# EAGLE board 8Enc (EAGLE 6.5.0)
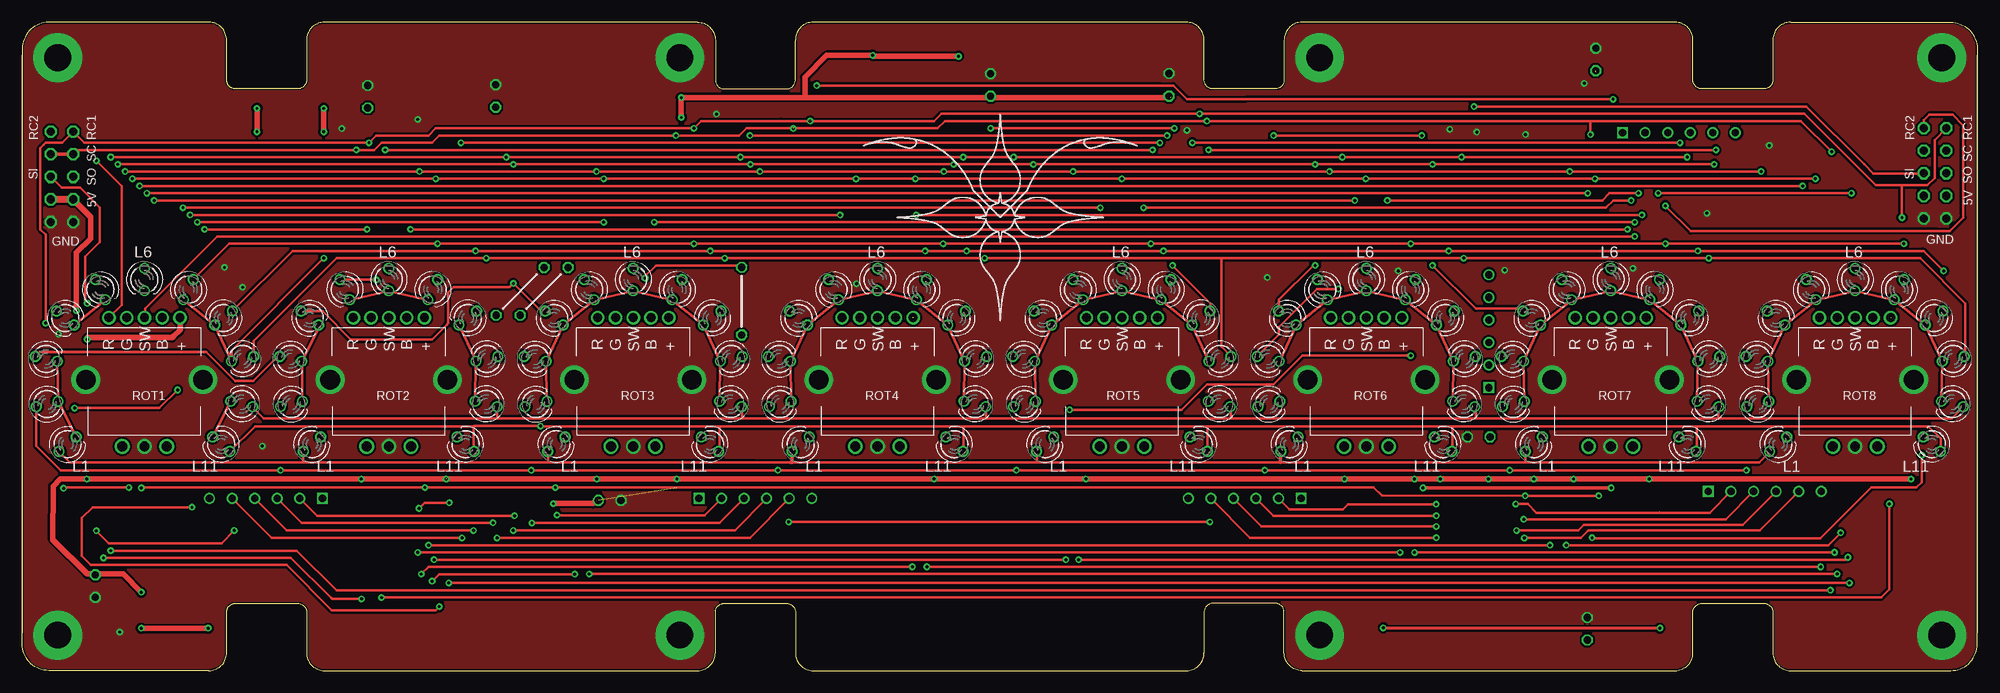
[diagram p2: board, top side]
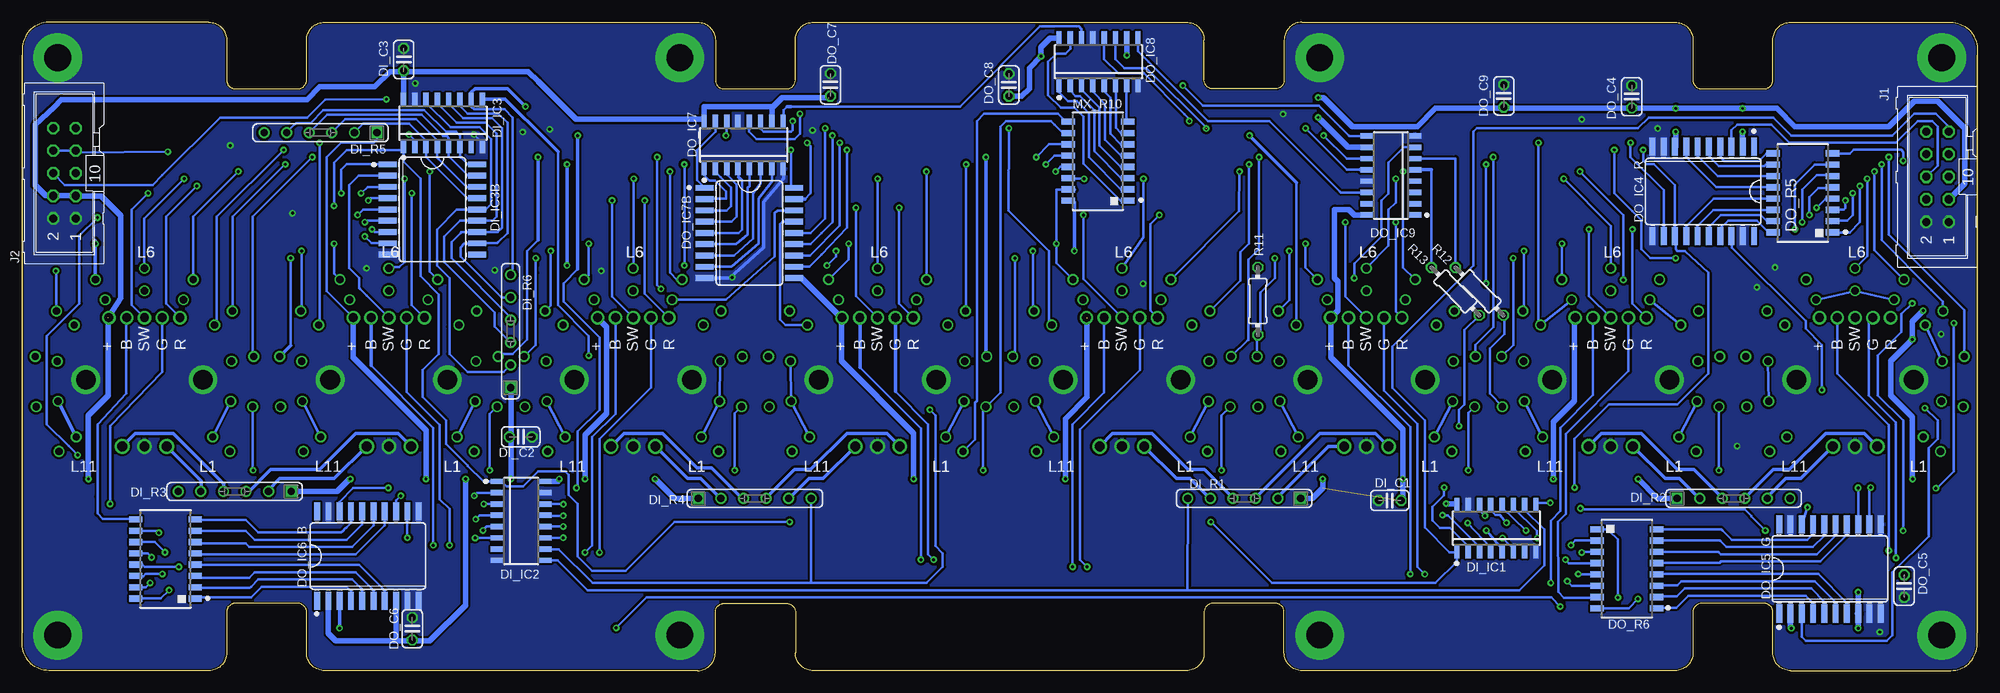
[diagram p3: board, bottom side, seen from below]

Size 220 x 73 mm. Coordinates in mm from the lower left corner, seen from the top.
Outline: 220,69.29 220,3 arc-90 217,0 199,0 arc-90 197,2 197,6.58 arc90 196,7.58 189,7.58 arc90 188,6.58 188,2 arc-90 186,0 144,0 arc-90 142,2 142,6.58 arc90 141,7.58 134,7.58 arc90 133,6.58 133,2 arc-90 131,0 89,0 arc-90 87,2 87,6.58 arc90 86,7.58 79,7.58 arc90 78,6.58 78,2 arc-90 76,0 34,0 arc-90 32,2 32,6.58 arc90 31,7.58 24,7.58 arc90 23,6.58 23,2 arc-90 21,0 3,0 arc-90 0,3 0,69.29
Outline: 0,4.28 0,70 arc-90 3,73 21,73 arc-90 23,71 23,66.5 arc90 24,65.5 31,65.5 arc90 32,66.5 32,71 arc-90 34,73 76,73 arc-90 78,71 78,66.5 arc90 79,65.5 86,65.5 arc90 87,66.5 87,71 arc-90 89,73 131,73 arc-90 133,71 133,66.5 arc90 134,65.5 141,65.5 arc90 142,66.5 142,71 arc-90 144,73 186,73 arc-90 188,71 188,66.5 arc90 189,65.5 196,65.5 arc90 197,66.5 197,71 arc-90 199,73 217,73 arc-90 220,70 220,4.28
Copper layers (1*16): Top 0.07mm / dielectric 1.6mm / Bottom 0.07mm
Design rules "001_MakePCB-8mil_min *": minimum track width 8mil, minimum drill 13mil, track to track 8mil, track to pad 8mil, pad to pad 8mil, via to via 8mil, smd to smd 8mil, copper to edge 8mil, drill to drill 8mil, minimum pad ring 8mil, minimum via ring 8mil, stop-mask expansion 2mil, vias tented up to drill 0mil, thermal gap 0mil
Net classes: 0 default: width 0.254 mm, drill 0.33 mm, clearance 0.254 mm; 1 VDD: width 0.61 mm, drill 0.33 mm, clearance 0.254 mm to class 0, clearance 0.254 mm

## Footprints (pad centres in the part's own frame; a part is rotated, then mirrored left to right if it is on the bottom)
C025-024X044 = drill 0.813 octagon: 1 -1.27,0; 2 1.27,0
SO16D = smd 0.6 x 1.4: 1 -4.481,-2.764; 2 -3.211,-2.764; 3 -1.941,-2.764; 4 -0.671,-2.764; 5 0.599,-2.764; 6 1.869,-2.764; 7 3.139,-2.764; 8 4.409,-2.764; 9 4.409,2.666; 10 3.139,2.666; 11 1.869,2.666; 12 0.599,2.666; 13 -0.671,2.666; 14 -1.941,2.666; 15 -3.211,2.666; 16 -4.481,2.666
SO18W = smd 0.66 x 2.032: 1 -5.08,-5.029; 2 -3.81,-5.029; 3 -2.54,-5.029; 4 -1.27,-5.029; 5 0,-5.029; 6 1.27,-5.029; 7 2.54,-5.029; 8 3.81,-5.029; 9 5.08,-5.029; 10 5.08,5.029; 11 3.81,5.029; 12 2.54,5.029; 13 1.27,5.029; 14 0,5.029; 15 -1.27,5.029; 16 -2.54,5.029; 17 -3.81,5.029; 18 -5.08,5.029
SIL6 = drill 0.813 square: 1 -6.35,0 | drill 0.813: 2 -3.81,0; 3 -1.27,0; 4 1.27,0; 5 3.81,0; 6 6.35,0
SO20W = smd 0.66 x 2.032: 1 -5.715,-5.029; 2 -4.445,-5.029; 3 -3.175,-5.029; 4 -1.905,-5.029; 5 -0.635,-5.029; 6 0.635,-5.029; 7 1.905,-5.029; 8 3.175,-5.029; 9 4.445,-5.029; 10 5.715,-5.029; 11 5.715,5.029; 12 4.445,5.029; 13 3.175,5.029; 14 1.905,5.029; 15 0.635,5.029; 16 -0.635,5.029; 17 -1.905,5.029; 18 -3.175,5.029; 19 -4.445,5.029; 20 -5.715,5.029
SOIC16W = smd 0.7 x 1.5: 1 -4.445,-3.346; 2 -3.175,-3.346; 3 -1.905,-3.346; 4 -0.635,-3.346; 5 0.635,-3.346; 6 1.905,-3.346; 7 3.175,-3.346; 8 4.445,-3.346; 9 4.445,3.346; 10 3.175,3.346; 11 1.905,3.346; 12 0.635,3.346; 13 -0.635,3.346; 14 -1.905,3.346; 15 -3.175,3.346; 16 -4.445,3.346
ML10 = drill 0.914 octagon: 1 -5.08,-1.27; 2 -5.08,1.27; 3 -2.54,-1.27; 4 -2.54,1.27; 5 0,-1.27; 6 0,1.27; 7 2.54,-1.27; 8 2.54,1.27; 9 5.08,-1.27; 10 5.08,1.27
0204/7 = drill 0.813 octagon: 1 -3.81,0; 2 3.81,0
PEL12T_11-LED-RING = drill 1.1: A -2.5,-7.5; B 2.5,-7.5; C 0,-7.5 | drill 0.813: A1 -9.619,-8.067; A2 -12.186,-3.035; A3 -12.289,2.612; A4 -9.894,7.73; A5 -5.505,11.287; A6 0,12.56; A7 5.508,11.288; A8 9.897,7.732; A9 12.282,2.615; A10 12.183,-3.034; A12 9.614,-8.072; K1 -7.673,-6.434; K2 -9.721,-2.42; K3 -9.804,2.084; K4 -7.893,6.166; K5 -4.392,9.004; K6 0,10.02; K7 4.394,9.005; K8 7.896,6.168; K9 9.798,2.087; K10 9.719,-2.42; K12 7.668,-6.439 | drill 1: LED_BLUE 2,7; LED_GREEN -2,7; LED_RED -4,7; PLUS 4,7; SWITCH 0,7 | drill 2.2: P$5 6.6,0; P$6 -6.6,0
3MM-PAD = drill 3 pad 5.5: B3 0,0

## Placement (x,y rotation side)
DI_C1  100nF  [C025-024X044]  66.1,19.16 180 bottom
DI_C2  100nF  [C025-024X044]  163.91,26.32 0 bottom
DI_C3  100nF  [C025-024X044]  177.07,68.8 90 bottom
DI_IC1  74HC165N  [SO16D]  54.08,16.09 0 bottom
DI_IC2  74HC165N  [SO16D]  163.8,16.82 270 bottom
DI_IC3  74HC165N  [SO16D]  172.62,61.7 0 bottom
DI_IC3B  [SO18W]  173.84,51.92 270 bottom
DI_R1  10k  [SIL6]  82.5,19.38 180 bottom
DI_R2  10k  [SIL6]  27.42,19.39 0 bottom
DI_R3  10k  [SIL6]  196.09,20.17 180 bottom
DI_R4  10k  [SIL6]  137.57,19.38 0 bottom
DI_R5  10k  [SIL6]  186.44,60.55 180 bottom
DI_R6  10k  [SIL6]  165.05,38.21 90 bottom
DO_C4  100nF  [C025-024X044]  38.89,64.61 90 bottom
DO_C5  100nF  [C025-024X044]  8.23,9.51 270 bottom
DO_C6  100nF  [C025-024X044]  176.11,4.71 90 bottom
DO_C7  100n  [C025-024X044]  129.05,65.95 90 bottom
DO_C8  100n  [C025-024X044]  108.97,65.93 90 bottom
DO_C9  100n  [C025-024X044]  53.27,64.7 90 bottom
DO_IC4_R  TPIC6B595  [SO20W]  30.84,53.95 180 bottom
DO_IC5_G  TPIC6B595  [SO20W]  16.58,11.45 0 bottom
DO_IC6_B  TPIC6B595  [SO20W]  181.1,12.9 0 bottom
DO_IC7  74HC595  [SO16D]  138.79,59.23 0 bottom
DO_IC7B  [SO18W]  138.18,49.27 270 bottom
DO_IC8  74HC595  [SO16D]  98.85,68.6 0 bottom
DO_IC9  74HC595  [SO16D]  66.04,55.78 90 bottom
DO_R5  220  [SOIC16W]  19.64,53.78 90 bottom
DO_R6  220  [SOIC16W]  39.44,11.46 270 bottom
DO_R7  220  [SOIC16W]  203.88,12.57 90 bottom
J1  [ML10]  4.47,55.6 90 bottom
J2  [ML10]  215.25,55.99 90 bottom
MX_R10  220  [SOIC16W]  98.96,57.35 90 bottom
R11  220  [0204/7]  80.96,41.6 90 bottom
R12  220  [0204/7]  56.02,42.7 135 bottom
R13  220  [0204/7]  58.73,42.7 135 bottom
ROT1  BOURNS_PEL12T  [PEL12T_11-LED-RING]  13.75,32.74 0 top
ROT2  BOURNS_PEL12T  [PEL12T_11-LED-RING]  41.25,32.74 0 top
ROT3  BOURNS_PEL12T  [PEL12T_11-LED-RING]  68.75,32.74 0 top
ROT4  BOURNS_PEL12T  [PEL12T_11-LED-RING]  96.25,32.74 0 top
ROT5  BOURNS_PEL12T  [PEL12T_11-LED-RING]  123.75,32.74 0 top
ROT6  BOURNS_PEL12T  [PEL12T_11-LED-RING]  151.25,32.74 0 top
ROT7  BOURNS_PEL12T  [PEL12T_11-LED-RING]  178.75,32.74 0 top
ROT8  BOURNS_PEL12T  [PEL12T_11-LED-RING]  206.25,32.74 0 top
U$2  3MM-PAD  [3MM-PAD]  4,69 0 top
U$3  3MM-PAD  [3MM-PAD]  4,4 0 top
U$4  3MM-PAD  [3MM-PAD]  74,4 0 top
U$5  3MM-PAD  [3MM-PAD]  146,4 0 top
U$6  3MM-PAD  [3MM-PAD]  216,4 0 top
U$7  3MM-PAD  [3MM-PAD]  216,69 0 top
U$8  3MM-PAD  [3MM-PAD]  74,69 0 top
U$9  3MM-PAD  [3MM-PAD]  146,69 0 top
U$10  [8ENC]  161.92,2.19 0 top
U$11  [VLRLAB]  41,3.08 0 top
U$12  [VLRLAB]  65,3.08 0 bottom
U$13  [8ENC]  161.91,2.09 0 bottom
U$14  [VLRLAB]  94.61,39.37 0 top

## Tracks (layer width: path | path; a pad name or v marks a point on that pad's centre or on a via)
+5V  (via drill 0.33)  (7 unrouted)
  Top 0.406: v159.56,21.57 v156.67,21.57 v156.67,21.56 | v148.79,21.57 147.32,21.57 147.32,21.56
  Top 0.61: v6.1,40.54 6.1,47.04 7.72,48.66 7.72,51.08 J1.4 | ROT1.PLUS 17.75,38.37 17.07,37.69 16.86,37.5 7.32,37.5 v7.32,37.29 | v212.55,21.56 v183.08,21.56 183.06,21.56 v174.57,21.56 v170.1,21.56 v165,21.56 v156.67,21.56 147.32,21.56 v119.69,21.56 v102.62,21.56 v64.64,21.56 v47.7,21.56 v38.15,21.56 v7.26,21.56 4.29,21.56 3.48,20.75 3.45,14.73 7.32,10.87 7.52,10.87 8.23,10.87 | v13.41,8.84 11.38,10.87 8.23,10.87 | v13.41,4.77 v20.93,4.77 | 129.24,64.52 88.09,64.52 | 88.09,64.52 v74.17,64.52 v74.17,62.28 | v26.42,60.65 v26.42,63.3 | v33.93,60.65 v33.93,63.3 | DO_C5.1 8.23,10.87 | v105.36,69.17 95.81,69.17 v95.71,69.27 90.53,69.27 88.09,66.83 88.09,64.52 | DI_C1.1 64.57,19.16 64.24,18.82 59.89,18.82 v59.77,18.8
  Top 0.813: J1.4 J1.3
  Bottom 0.254: 73.66,20.55 73.76,20.55 73.76,21.56
  Bottom 0.305: DI_R5.1 180.09,59.79 180.44,59.44 184.1,59.44 185.72,57.81 185.72,42.72 ROT7.PLUS | v165,21.56 165.18,21.74 DI_C2.1
  Bottom 0.61: ROT7.PLUS 182.75,35.25 174.55,27.05 v174.57,21.56 | v7.26,21.56 7.32,21.64 7.32,28.55 9.75,30.99 9.75,34.85 v7.32,37.29 7.32,39.32 v6.1,40.54 | v212.55,21.56 212.55,28.75 210.31,30.99 210.31,39.72 | ROT6.PLUS 155.25,39.72 154.23,38.71 154.23,28.95 156.67,26.52 v156.67,21.56 | ROT5.PLUS 127.81,39.68 | 127.81,39.68 127.81,34.85 119.69,26.72 v119.69,21.56 | 100.18,39.67 100.18,30.78 102.62,28.34 v102.62,21.56 | ROT2.PLUS 45.31,39.68 45.31,30.38 47.7,27.99 47.7,21.62 | 13.41,6.43 v13.41,8.84 | DO_IC5_G.8 v13.41,4.77 | v20.93,4.77 21.02,5.07 DO_IC5_G.2 | DI_R6.1 165,31.81 v165,21.56 | 143.27,63.39 DO_IC7.16 143.44,62.08 157.68,62.08 161.95,66.34 161.97,66.34 163.07,67.44 177.09,67.44 | 143.26,63.5 135.64,63.5 | v74.17,64.52 73.56,64.52 70.31,61.26 62.99,61.26 60.96,63.3 53.24,63.3 39.01,63.3 v33.93,63.3 v26.42,63.3 22.55,63.3 20.52,61.26 9.96,61.26 7.11,64.11 4.47,64.11 1.42,61.06 1.42,54.84 J1.3 | ROT8.PLUS 210.33,39.74 208.89,41.96 208.89,48.36 208.89,49.58 208.89,51.21 211.12,53.44 J2.3 J2.4 217.22,53.45 217.35,53.45 218.55,54.65 218.52,61.49 216.41,63.46 215.59,64.29 187.96,64.29 186.54,65.71 180.34,65.71 178.61,67.44 177.09,67.44 | DO_IC6_B.2 185.55,4.19 184.71,3.35 178,3.35 | 178,3.35 176.17,3.35 | 176.17,3.35 174.14,3.35 170.13,7.37 v170.1,21.56 | DO_IC6_B.8 177.93,3.43 178,3.35 | DO_C6.1 176.11,3.42 176.17,3.35 | DO_IC9.16 70.09,51.3 70.71,51.92 71.12,51.92 72.34,51.92 72.34,44.2 71.93,43.79 71.93,40.56 ROT3.PLUS 72.75,35.25 64.62,27.13 64.62,21.61 v64.64,21.56 64.64,19.16 DI_C1.1 | DO_IC9.10 70.81,58.92 v74.17,62.28 | DO_IC4_R.2 26.42,59 v26.42,60.65
  Bottom 0.61: DO_IC4_R.8 arc-90 33.93,59.06 v33.93,60.65 | 127.81,39.68 132.33,44.2 DO_IC7B.10 | DI_IC3.16 177.09,64.37 177.09,67.44 | 135.64,61.91 DO_IC7.10 135.65,63.49 135.64,63.5 | DO_IC8.10 95.71,71.26 v95.71,69.27 | DO_IC8.16 103.4,71.2 104.34,71.2 105.36,70.18 v105.36,69.17 106.68,67.85 106.68,65.51 107.53,64.66 DO_C8.1 | DI_R1.1 74.82,19.38 73.66,20.55 v73.66,21.57 | v59.77,18.8 58.76,18.8 DI_IC1.16 | DI_R2.1 35.98,19.39 v38.15,21.56 | DI_R4.1 146.61,19.38 v148.79,21.56 | DI_R3.1 184.56,20.16 183.16,21.56 v183.08,21.56 | DO_C7.1 129.24,64.49 134.52,64.49 135.51,63.5 135.64,63.5 | DI_IC2.16 159.83,21.3 arc-90 v159.56,21.57
  Bottom 0.813: 13.41,6.43 DO_IC5_G.8 | DO_C4.1 38.88,63.3 39.01,63.3 | DO_C9.1 53.27,63.3 53.24,63.3
DI_IC3_SW1
  Bottom 0.254: DI_IC3.11 170.75,63.56 169.88,62.69 166.42,62.69 165.41,61.67 165.41,49.27 166.42,48.26 166.57,48.11 DI_IC3B.11
  Bottom 0.305: DI_R6.5 166.07,42.02 170.69,46.63 170.69,47.65 170.28,48.06 168.86,48.06
  Bottom 0.406: 168.86,48.06 DI_IC3B.11
DI_IC3_SW2
  Bottom 0.254: DI_IC3.12 172.02,63.81 170.38,62.18 167.13,62.18 166.01,61.06 166.01,49.88 166.42,49.48 166.52,49.38 DI_IC3B.12
  Bottom 0.305: DI_R6.4 165.05,39.77 171.7,46.43 171.7,48.26 170.69,49.27 170.59,49.38 DI_IC3B.12
DI_IC3_SW3
  Bottom 0.254: DI_IC3.13 173.29,63.87 171.09,61.67 167.84,61.67 166.62,60.45 166.62,51.1 167.08,50.65 DI_IC3B.13
  Bottom 0.305: DI_R6.3 166.83,38.72 166.83,40.33 172.52,46.02 172.52,48.87 170.74,50.65 DI_IC3B.13
DI_IC3_SW4
  Bottom 0.254: DI_IC3.14 174.56,63.92 174.55,63.91 171.81,61.16 168.55,61.16 167.23,59.84 167.23,52.53 167.84,51.92 DI_IC3B.14
  Bottom 0.305: DI_IC3B.14 171.09,51.92 173.33,49.68 173.33,45.62 171.91,44.2 171.91,38.71 171.91,35.66 169.88,33.63 165.81,33.63 165.04,34.4
  Bottom 0.406: 165.04,34.4 DI_R6.2
DI_IC3_SW5
  Bottom 0.254: 174.56,59.65 176.48,61.57 181.61,61.57 DI_R5.2
  Bottom 0.305: DI_IC3.3 174.56,59.65 | DI_IC3B.15 169.93,53.19 174.55,57.81 DI_IC3.3
  Bottom 0.406: DI_IC3.3
DI_IC3_SW6
  Bottom 0.254: DI_IC3.4 173.29,59.7 175.67,62.08 183.64,62.08 DI_R5.3
  Bottom 0.305: DI_IC3B.16 169.98,54.46 173.13,57.61 173.29,57.77 DI_IC3.4
DI_IC3_SW7
  Bottom 0.254: DI_IC3.5 172.02,59.95 172.21,60.15 172.62,60.15 175.06,62.58 185.67,62.58 DI_R5.4
  Bottom 0.305: DI_IC3B.17 169.82,55.73 171.91,57.81 172.02,57.92 DI_IC3.5
DI_IC3_SW8
  Bottom 0.254: DI_IC3.6 170.75,60.21 171.09,60.55 171.2,60.65 172.31,60.65 174.75,63.09 186.08,63.09 | 186.08,63.09 186.11,63.09 | 186.11,63.09 186.08,63.09 | 186.08,63.09 186.11,63.09 | 186.11,63.09 187.55,61.65 189.18,61.65 189.38,61.45 DI_R5.5
  Bottom 0.305: DI_IC3B.18 169.88,57 170.69,57.81 | 170.75,57.87 DI_IC3.6
  Bottom 0.406: 170.69,57.81 170.75,57.87
DI_IC4_SER_OUT2
  Bottom 0.305: DI_IC1.10 51,18.75 51,18.16 48.69,15.9 48.69,11.87 51.51,9.05 57.56,9.05 88.88,9.05 | 88.88,9.05 149.33,9.05 156.36,9.05 159.74,12.42 161.12,12.42 DI_IC2.9 | DI_R1.6 88.88,9.05
DI_IC5_SER_OUT2  (via drill 0.33)
  Top 0.305: 155.85,35.46 144.07,35.46 140.82,32.21 133.3,32.21 130.45,29.36 118.47,29.36 v117.86,29.36
  Top 0.406: v156.26,35.46 155.85,35.46
  Bottom 0.305: 159.72,58.42 159.72,41.15 156.26,37.69 v156.26,35.46 | v117.86,29.36 117.25,28.75 117.25,14.02 116.43,13.21 116.43,11.69 118.26,9.86 131.24,9.86 | DI_IC2.10 159.65,13.68 155.83,9.86 131.24,9.86 | DI_R4.6 131.22,9.88 131.24,9.86
  Bottom 0.406: DI_IC3.9 165.66,64.36 165.2,63.91 161.34,60.04 159.72,58.42
DO_IC4_R_QA
  Bottom 0.305: DO_R5.9 23.75,58.22 24.59,57.38 28.45,57.38 28.85,57.79 28.85,58.9 DO_IC4_R.4
DO_IC4_R_QB
  Bottom 0.305: DO_R5.10 23.8,56.95 23.98,56.77 29.06,56.77 30.07,57.79 30.07,58.85 DO_IC4_R.5
DO_IC4_R_QC
  Bottom 0.305: DO_R5.11 29.19,55.68 31.5,57.99 31.5,58.96 DO_IC4_R.6
DO_IC4_R_QD
  Bottom 0.305: DO_R5.12 29.34,54.41 32.72,57.79 32.72,58.95 DO_IC4_R.7
DO_IC4_R_QE
  Bottom 0.305: DO_R5.13 29.64,53.14 32.72,50.07 32.72,48.95 DO_IC4_R.14
DO_IC4_R_QF
  Bottom 0.305: DO_R5.14 29.69,51.87 31.5,50.07 31.5,48.94 DO_IC4_R.15
DO_IC4_R_QG
  Bottom 0.305: DO_R5.15 23.7,50.6 24.38,51.29 28.85,51.29 30.07,50.07 30.07,49.05 DO_IC4_R.16
DO_IC4_R_QH
  Bottom 0.305: DO_R5.16 23.45,49.33 24.79,50.68 28.04,50.68 28.85,49.86 28.85,49 DO_IC4_R.17
DO_IC4_R_SEROUT  (via drill 0.33)
  Top 0.305: v17.48,31.6 15.44,29.56 v5.89,29.56
  Bottom 0.305: 27.64,48.92 27.64,47.65 19.3,39.34 19.3,38.51 17.48,36.68 v17.48,31.6 | v5.89,29.56 4.47,28.14 4.47,26.11 5.49,25.09 5.49,15.14 9.55,11.07 9.55,5.79 9.55,3.96 10.16,3.35 19.3,3.35 19.75,3.8 DO_IC5_G.3
  Bottom 0.406: DO_IC4_R.18 27.64,48.92
DO_IC5_G_QA
  Bottom 0.305: DO_IC5_G.4 18.48,7.61 19.3,8.43 32.51,8.43 33.86,7.08 36.03,7.08 DO_R6.9
DO_IC5_G_QB
  Bottom 0.305: DO_IC5_G.5 17.21,7.76 18.69,9.24 32.92,9.24 33.81,8.35 36.03,8.35 DO_R6.10
DO_IC5_G_QC
  Bottom 0.305: DO_IC5_G.6 15.94,7.71 18.29,10.06 33.33,10.06 33.76,9.62 36.03,9.62 DO_R6.11
DO_IC5_G_QD
  Bottom 0.305: DO_IC5_G.7 14.67,7.66 17.88,10.87 36.12,10.87 36.09,10.85 DO_R6.12
DO_IC5_G_QE
  Bottom 0.305: DO_IC5_G.14 14.67,15.3 17.68,12.29 28.85,12.29 28.99,12.16 36.03,12.16 DO_R6.13
DO_IC5_G_QF
  Bottom 0.305: DO_IC5_G.15 15.94,15.25 18.09,13.11 28.85,13.11 | 29.08,13.33 28.85,13.11 | 28.85,13.11 29.08,13.33 | 29.08,13.33 29.12,13.37 DO_R6.14
DO_IC5_G_QG
  Bottom 0.305: DO_IC5_G.16 17.21,15.2 18.49,13.92 28.25,13.92 | 28.93,14.6 28.25,13.92 | 28.25,13.92 28.93,14.6 | 28.93,14.6 28.97,14.64 DO_R6.15
DO_IC5_G_QH
  Bottom 0.305: 18.49,16.27 18.49,15.34 19.1,14.73 27.64,14.73 | 28.67,15.77 27.64,14.73 | 27.64,14.73 28.67,15.77 | 28.67,15.77 28.81,15.91 DO_R6.16
  Bottom 0.406: DO_IC5_G.17 18.49,16.27
DO_IC5_G_SEROUT  (via drill 0.33)
  Top 0.305: v19.1,18.39 18.29,18.39 7.92,18.39 6.71,17.17 6.71,12.9 7.72,11.89 29.77,11.89 34.85,6.81 46.53,6.81 v46.94,7.21
  Top 0.406: v153.16,4.8 v184.3,4.77
  Bottom 0.305: 19.71,16.53 v19.1,18.39 | v46.94,7.21 47.95,8.23 149.73,8.23 v153.16,4.8
  Bottom 0.406: DO_IC5_G.18 19.71,16.53 | v184.3,4.77 184.28,6.58 DO_IC6_B.3
DO_IC6_B_QA
  Bottom 0.305: DO_IC6_B.4 183.01,8.97 183.49,9.45 193.04,9.45 194.26,8.23 200.54,8.23 DO_R7.1
DO_IC6_B_QB
  Bottom 0.305: DO_IC6_B.5 181.74,9.12 181.86,9.24 182.88,10.26 193.45,10.26 194.26,9.45 194.41,9.3 200.54,9.3 DO_R7.2
DO_IC6_B_QC
  Bottom 0.305: DO_IC6_B.6 180.47,9.07 182.47,11.07 193.85,11.07 194.46,10.46 200.54,10.46 DO_R7.3
DO_IC6_B_QD
  Bottom 0.305: DO_IC6_B.7 179.2,9.02 182.07,11.89 200.54,11.89 DO_R7.4
DO_IC6_B_QE
  Bottom 0.305: DO_IC6_B.14 179.2,16.38 182.47,13.11 200.54,13.11 DO_R7.5
DO_IC6_B_QF
  Bottom 0.305: DO_IC6_B.15 180.47,16.33 182.88,13.92 194.46,13.92 194.87,14.32 200.54,14.32 DO_R7.6
DO_IC6_B_QG
  Bottom 0.305: DO_IC6_B.16 181.74,16.48 183.49,14.73 193.85,14.73 194.87,15.75 DO_R7.7
DO_IC6_B_QH
  Bottom 0.305: DO_IC6_B.17 183.01,16.64 183.49,16.15 183.69,15.95 183.9,15.75 184.1,15.54 193.45,15.54 194.87,16.97 200.54,16.97 DO_R7.8
DO_IC6_B_SEROUT  (via drill 0.33)  (1 unrouted)
  Top 0.305: v157.48,60.25 v140.82,60.25
  Top 0.406: v178.82,20.57 v157.63,20.57
  Bottom 0.305: 184.3,17.93 184.3,19 182.75,20.57 v178.82,20.57 | 157.48,45.21 159.11,43.59 159.11,41.55 155.04,37.49 155.04,29.36 157.48,26.92 157.48,21.31 157.48,20.7 v157.63,20.57 | DO_IC7.14 140.73,60.34
  Bottom 0.406: 157.48,45.21 v157.48,60.25 | 140.73,60.34 v140.82,60.25
DO_IC7_QA
  Bottom 0.305: DO_IC7B.1 144.07,55.22 144.07,58.62 142,60.69 DO_IC7.15
DO_IC7_QB
  Bottom 0.305: 143.15,53.14 140.82,53.14 140.82,53.74 140.82,53.95 142.04,55.17 142.24,55.17 142.65,55.17 143.27,55.79 DO_IC7.1
  Bottom 0.406: DO_IC7B.2 143.15,53.14
DO_IC7_QC
  Bottom 0.305: DO_IC7B.3 140.72,51.81 140.21,52.32 140.21,54.35 141.43,55.57 142,56.14
  Bottom 0.406: 142,56.14 DO_IC7.2
DO_IC7_QD
  Bottom 0.305: DO_IC7B.4 140.16,50.55 139.6,51.1 139.6,54.73 140.61,55.78 140.61,56.35
  Bottom 0.406: 140.61,56.35 DO_IC7.3
DO_IC7_QE
  Bottom 0.305: DO_IC7B.5 139.4,49.27 138.99,49.68 138.99,55.17 | 139.4,55.57 139.46,56.53
  Bottom 0.406: 138.99,55.17 139.4,55.57 | 139.46,56.53 DO_IC7.4
DO_IC7_QF
  Bottom 0.305: DO_IC7B.6 139.65,48.01 138.38,49.07 138.38,54.35 138.18,54.56 138.18,56.25
  Bottom 0.406: 138.18,56.25 DO_IC7.5
DO_IC7_QG
  Bottom 0.305: DO_IC7B.7 139.9,46.73 137.77,48.66 137.77,53.74 136.96,54.76 136.92,54.8 DO_IC7.6
DO_IC7_QH
  Bottom 0.305: DO_IC7B.8 140.16,45.47 137.16,48.06 137.16,53.14 135.74,54.96 135.65,55.05 DO_IC7.7
DO_IC7_SEROUT
  Bottom 0.305: 134.31,61.96 134.31,63.09 133.91,63.5 | DO_IC8.14 100.79,72.22 101.09,72.52 101.24,72.52 105.05,72.52 105.46,72.52 114.48,63.5 133.5,63.5
  Bottom 0.406: DO_IC7.9 134.31,61.96 | 133.91,63.5 133.5,63.5
DO_IC8_QA
  Bottom 0.305: MX_R10.1 95.62,52.91 96.42,52.91 100.58,57.08 100.58,62.36 101.6,63.38 103.12,63.38 104.55,64.8 104.55,68.56 103.63,69.47 102.62,69.47 102.07,70.02 DO_IC8.15
DO_IC8_QB
  Bottom 0.305: MX_R10.2 95.63,54.16 96.34,54.16 99.97,57.79 99.97,62.77 101.3,64.09 102.31,64.09 103.34,65.11 | 103.34,65.11 103.34,65.31 | 103.34,65.31 DO_IC8.1 | 103.34,65.11 103.34,65.31
DO_IC8_QC
  Bottom 0.305: DO_IC8.2 102.07,65.27 101.5,64.7 100.99,64.7 99.36,63.07 99.36,58.48 96.34,55.45 96.33,55.44 MX_R10.3
DO_IC8_QD
  Bottom 0.305: MX_R10.4 95.63,56.7 96.34,56.7 98.75,59.11 98.75,63.38 100.8,65.42 | 100.8,65.42 DO_IC8.3 100.8,65.42
DO_IC8_QE
  Bottom 0.305: MX_R10.5 95.62,57.99 96.34,57.99 98.15,59.8 98.15,63.78 99.53,65.16 DO_IC8.4 99.53,65.37
DO_IC8_QF
  Bottom 0.305: MX_R10.6 95.63,59.24 96.34,59.24 97.54,60.43 97.54,64.49 98.26,65.21 DO_IC8.5
DO_IC8_QG
  Bottom 0.305: MX_R10.7 95.62,60.53 96.34,60.53 96.93,61.12 96.93,65.31 96.99,65.37 DO_IC8.6
DO_IC8_QH
  Bottom 0.305: MX_R10.8 95.72,61.89 DO_IC8.7
DO_IC8_SEROUT
  Bottom 0.305: DO_IC9.14 71.62,53.84 71.73,53.95 79.65,61.87 82.09,61.87 82.48,61.87 82.5,61.88 83.62,61.88 86.59,61.88 91.14,66.42 93.27,68.56 94.45,69.74 DO_IC8.9
DO_IC9_QF
  Bottom 0.305: 61.42,56.38 R13.2
  Bottom 0.406: DO_IC9.5 61.42,56.38
DO_IC9_QG
  Bottom 0.305: DO_IC9.6 58.71,57.65 R12.2
DO_IC9_QH  (via drill 0.33)
  Top 0.305: v70.1,44.2 70.1,44.4 71.32,45.62 80.75,45.62 R11.2
  Bottom 0.305: DO_IC9.7 64.53,58.92 66.24,57.2 66.24,53.73 67.06,52.91 67.06,48.87 70.1,45.82 v70.1,44.2
GND  (via drill 0.33)
  Bottom 0.254: DI_IC3.8 168.21,59.4 v169.16,60.35
  Bottom 0.406: DO_IC7B.9 140.41,44.2 136.55,47.65 136.55,52.73 134.31,55.37 134.31,56.2 DO_IC7.8
  other vias: 44.5,62.06 35.97,61.04 4.06,37.88 22.76,45.39 24.79,43.16 10.97,4.35 27.03,25.28 181.25,45.29 163.68,60.63 166.83,45.09 189.59,51.49 196.6,59.11 154.84,44.99 160.63,60.94 175.77,66.12 140.11,44.28 78.13,62.67 93.88,43.56 131.06,60.84
  pour Bottom: -1.02,74.33 222.5,74.83 222.5,-1.32 -1.02,-1.32
  pour Top: -1.02,74.33 222.5,74.83 222.5,-1.32 -1.02,-1.32
MATRIXLED1
  Top 0.305: ROT1.A1 5.34,23.47 31.62,23.47 | 31.62,23.47 59.05,23.47 | 59.05,23.47 59.18,23.47 59.18,24.62 | 86.61,23.47 114.17,23.47 | 114.17,23.47 141.6,23.47 169.16,23.47 | 169.16,23.47 195.48,23.47 196.63,24.62 | ROT2.A1 31.62,24.67 31.62,23.47 | 114.17,24.63 114.17,23.47 | 169.16,24.64 169.16,23.47 | 86.49,23.44 82.42,23.44 59.08,23.44 59.05,23.47
  Top 0.406: 196.63,24.62 ROT8.A1 | ROT3.A1 59.18,24.62 | ROT4.A1 86.61,24.66 86.61,23.57 | 86.61,23.57 86.61,23.47 | ROT5.A1 114.17,24.63 | ROT6.A1 141.6,24.65 141.6,23.47 | ROT7.A1 169.16,24.64 | 86.49,23.44 86.61,23.57
  Bottom 0.305: 102.62,61.87 103.43,62.69 111.76,62.69 112.57,61.87 112.57,30.38 112.78,30.17 112.78,26.03 ROT5.A1
  Bottom 0.406: MX_R10.9 101.92,61.79 102.01,61.87 102.62,61.87
MATRIXLED2  (via drill 0.33)
  Top 0.305: ROT1.A2 1.6,29.67 1.6,25.27 4.32,22.55 v29.06,22.55 v57.28,22.55 v85.04,22.55 v111.86,22.55 v139.83,22.55 v167.39,22.55 v194.03,22.55
  Bottom 0.305: ROT8.A2 194.06,23.24 v194.03,22.55 | ROT7.A2 167.39,28.89 v167.39,22.55 | ROT6.A2 139.83,28.95 v139.83,22.55 | v111.86,22.55 111.86,29.41 ROT5.A2 109.93,31.34 109.93,61.26 109.32,61.87 104.24,61.87 103.83,61.47 102.89,60.52 | ROT4.A2 85.04,28.73 v85.04,22.55 | ROT3.A2 57.28,29 v57.28,22.55 | 29.08,29.69 ROT2.A2 v29.06,22.55
  Bottom 0.406: MX_R10.10 102.89,60.52
MATRIXLED3  (via drill 0.33)
  Top 0.305: v9.96,57.81 v54.46,57.81 v80.82,57.81 v105.89,57.81 v111.56,57.81 v148.54,57.81 v161.95,57.81 v187.35,57.81 | ROT2.A3 28.75,35.35 26.01,32.61 23.98,32.61 20.73,35.86 1.97,35.86 ROT1.A3 | ROT6.A3 141.43,37.82 141.43,38.51 141.43,38.71 145.69,42.98 v148.13,42.98
  Bottom 0.305: ROT1.A3 1.46,40.58 9.96,49.07 v9.96,57.81 | v187.35,57.81 194.06,51.1 194.06,35.45 ROT8.A3 | ROT3.A3 56.49,35.38 56.49,36.68 54.46,38.71 54.46,38.78 v54.46,57.81 | ROT4.A3 82.09,37.22 82,37.22 82,46 82,46.3 80.82,47.48 v80.82,57.81 | v148.13,42.98 148.54,43.38 v148.54,57.81 | ROT7.A3 166.16,35.66 165,35.66 164.79,35.66 163.17,37.29 163.17,44.4 163.17,44.8 163.17,47.24 161.95,48.46 | v105.89,57.81 104.45,59.25 MX_R10.11
  Bottom 0.406: ROT5.A3 111.56,35.35 v111.56,57.81 | 161.95,48.46 v161.95,57.81
MATRIXLED4  (via drill 0.33)  (1 unrouted)
  Top 0.305: v190.4,57 v158.7,57 v145.49,57 v113.79,57 v104.8,57 v81.94,57 v55.27,57 11.38,57 v10.77,57 | ROT6.A4 141.43,40.54 141.43,41.76 145.29,45.62 v145.49,45.62 | ROT7.A4 168.72,40.47 168.45,40.74 163.58,40.74 v158.7,45.62 | ROT2.A4 33.8,40.47 36.98,37.29 46.13,37.29 47.75,38.91 47.95,39.12 47.95,42.57 48.56,43.18 54.39,43.18 54.86,43.18 v55.27,43.59 58.38,40.47 ROT3.A4
  Bottom 0.305: ROT8.A4 196.29,40.54 196.29,51.1 v190.4,57 | v10.77,57 10.77,48.46 5.18,42.87 3.86,41.55 ROT1.A4 | 113.79,40.47 v113.79,57 | 55.27,43.57 55.27,44.07 v55.27,57 | ROT4.A4 82.91,43.92 82.91,46.41 82.91,47.09 81.95,48.05 v81.94,57 | v145.49,45.62 v145.49,57 | v104.8,57 103.84,57.98 MX_R10.12
  Bottom 0.406: ROT5.A4 113.79,40.47 | v158.7,45.62 v158.7,57
MATRIXLED5  (via drill 0.33)
  Top 0.305: v11.58,56.18 v44.7,56.18 v64.62,56.18 v83.01,56.18 v103.71,56.18 v118.26,56.18 v147.12,56.18 v174.14,56.18 v195.68,56.18 | ROT2.A5 39.79,44.03 v39.83,43.99
  Bottom 0.305: ROT1.A5 11.58,47.37 v11.58,56.18 | 195.66,56.17 v195.68,56.18 200.76,51.1 ROT8.A5 | ROT6.A5 145.78,43.99 146.3,43.99 147.12,44.79 v147.12,56.18 | ROT5.A5 v118.26,56.18 | v39.83,43.99 39.83,51.29 v44.7,56.18 | ROT3.A5 64.62,45.4 v64.62,56.18 | ROT4.A5 83.06,51.72 v83.01,56.18 | MX_R10.13 103.18,56.72 v103.71,56.18 | ROT7.A5 174.14,44.93 v174.14,56.18
MATRIXLED6  (via drill 0.33)
  Top 0.305: v12.39,55.37 v46.53,55.37 v65.43,55.37 v93.83,55.37 | v93.83,55.37 v123.75,55.37 v151.18,55.37 v176.99,55.37 v201.78,55.37 | v100.51,55.38 v100.5,55.37 v93.83,55.37
  Bottom 0.305: ROT8.A6 206.25,50.9 v201.78,55.37 | ROT1.A6 12.39,46.66 v12.39,55.37 | ROT5.A6 v123.75,55.37 | ROT2.A6 41.25,50.07 | 41.25,50.07 | 41.25,50.07 v46.53,55.37 | ROT3.A6 66.24,47.88 66.24,51.9 65.43,52.71 v65.43,55.37 | ROT4.A6 93.83,48.82 v93.83,55.37 | 151.18,45.37 v151.18,55.37 | ROT7.A6 178.64,45.41 177.6,45.41 176.99,46.02 v176.99,55.37 | v100.51,55.38 102.32,55.37 MX_R10.14
  Bottom 0.406: v46.53,55.37 | ROT6.A6 151.18,45.37
MATRIXLED7  (via drill 0.33)
  Top 0.305: ROT1.A7 23.28,48.06 v46.74,48.06 v75.59,48.06 v103.63,48.06 v127,48.06 v156.26,48.06 v184.91,48.06 v211.73,48.06
  Bottom 0.305: ROT2.A7 46.76,48.03 | ROT3.A7 75.59,45.36 v75.59,48.06 | ROT4.A7 103.63,45.9 v103.63,48.06 103.63,54.15 102.62,54.15 | ROT5.A7 127,46.29 v127,48.06 | ROT7.A7 184.91,44.68 v184.91,48.06 | ROT6.A7 156.26,44.53 v156.26,48.06
  Bottom 0.406: v211.73,48.06 211.76,48.44 ROT8.A7 | 46.76,48.03 v46.74,48.06 | MX_R10.15 101.58,54.15 102.62,54.15
MATRIXLED8  (via drill 0.33)
  Top 0.305: ROT1.A8 30.42,47.24 v51,47.24 v77.42,47.24 v101.6,47.24 v106.27,47.24 v128.42,47.24 v160.53,47.24 v188.57,47.24 213.77,47.24 213.97,47.24 v216.21,45.01 | ROT5.A8 133.71,40.53 133.71,41.15 133.71,41.35 v129.44,45.62
  Bottom 0.305: 216.15,45.15 ROT8.A8 | ROT4.A8 106.27,40.47 v106.27,47.24 | ROT2.A8 51,40.62 v51,47.24 | v129.44,45.62 128.42,46.63 v128.42,47.24 | ROT3.A8 77.42,41.7 v77.42,47.24 | ROT6.A8 160.53,41.09 v160.53,47.24 | ROT7.A8 188.57,40.55 v188.57,47.24
  Bottom 0.406: v216.21,45.01 216.15,45.15 | MX_R10.16 101.6,52.74 v101.6,47.24
MATRIXLED9  (via drill 0.33)
  Top 0.305: ROT1.A9 26.03,37.1 35.36,46.43 v52.22,46.43 v79.05,46.43 v108.31,46.43 134.93,46.43 | 134.93,46.43 v162.2,46.43 v189.79,46.43 213.56,46.43 218.64,41.35 218.64,35.47 ROT8.A9 | ROT5.A9 134.93,36.47 134.93,46.43
  Bottom 0.305: ROT4.A9 108.31,35.36 v108.31,46.43 | ROT2.A9 52.22,36.67 v52.22,46.43 | ROT6.A9 162.2,36.69 162.2,44.8 162.2,45.62 v162.2,46.43 | 189.79,36.6 v189.79,46.43 | ROT3.A9 81.03,37.72 R11.1 80.67,38.08 80.67,42.55 79.05,44.17 v79.05,46.43
  Bottom 0.406: ROT7.A9 189.79,36.6
MATRIXLED10
  Top 0.305: ROT8.A10 217.12,28.4 190.88,28.4 | 190.88,28.4 163.58,28.4 | 163.58,28.4 136.02,28.4 | 136.02,28.4 108.46,28.4 | 108.46,28.4 81.03,28.4 | 81.03,28.4 53.47,28.4 | 53.47,28.4 27.3,28.4 27.18,28.4 25.93,29.64 ROT1.A10 | ROT2.A10 53.47,29.67 53.47,28.4 | 81.03,29.61 81.03,28.4 | 108.46,29.68 108.46,28.4 | ROT5.A10 136.02,29.62 136.02,28.4 | ROT6.A10 163.58,29.57 163.58,28.4 | ROT7.A10 190.88,29.66 190.88,28.4
  Top 0.406: ROT3.A10 81.03,29.61 | ROT4.A10 108.46,29.68
  Bottom 0.305: R12.1 53.24,39.96 53.24,37.9 54.86,36.27 54.86,31.19 53.43,29.76
  Bottom 0.406: 53.43,29.76 ROT2.A10
MATRIXLED11  (via drill 0.33)
  Top 0.305: ROT1.A12 26.2,27.51 50.8,27.51 | 78.64,27.51 78.49,27.51 78.49,24.79 | 78.64,27.51 105.92,27.51 | 105.92,27.51 133.35,27.51 | 133.35,27.51 160.91,27.51 | 160.91,27.51 164.97,27.51 165.35,27.51 188.47,27.51 | 188.47,27.51 214.5,27.51 215.86,26.15 ROT8.A12 | ROT2.A12 50.8,24.73 50.8,27.51 | 105.92,24.72 105.92,27.51 | 133.35,24.68 133.35,27.51 | 160.91,24.71 160.91,27.51 | 188.47,24.77 188.47,27.51 | 50.8,27.51 50.83,27.53 v58.32,27.53 58.34,27.51 78.64,27.51
  Top 0.406: ROT3.A12 78.49,24.79 | ROT4.A12 105.92,24.72 | ROT5.A12 133.35,24.68 | ROT6.A12 160.91,24.71 | ROT7.A12 188.47,24.77
  Bottom 0.305: R13.1 57.71,38.33 57.71,29.97 58.32,29.36 v58.32,27.53
  Bottom 0.406: v58.32,27.53 58.32,27.51
MATRIXROT1  (via drill 0.33)
  Top 0.305: ROT1.K12 ROT1.K10 | ROT1.K7 ROT1.K8 ROT1.K9 23.55,36.04 v33.93,46.43 | ROT1.K5 ROT1.K4 | ROT1.K3 ROT1.K2 ROT1.K1 | v40.84,58.62 v127.2,58.62
  Bottom 0.305: ROT1.K10 ROT1.K9 | ROT1.K7 ROT1.K6 ROT1.K5 | ROT1.K4 ROT1.K3 | v33.93,46.43 36.78,46.43 37.8,47.45 37.8,50.7 38.81,51.71 40.84,53.74 40.84,58.42 v40.84,58.62 | v127.2,58.62 127.2,49.88 130.05,46.84 131.42,45.47 DO_IC7B.11
MATRIXROT2  (via drill 0.33)
  Top 0.305: ROT2.K10 ROT2.K9 | 51.05,34.87 ROT2.K8 | ROT2.K7 ROT2.K6 ROT2.K5 | ROT2.K4 33.53,38.94 ROT2.K3 31.5,35.13 ROT2.K2 | v49.38,59.44 v128.02,59.44
  Top 0.406: ROT2.K9 51.05,34.87
  Bottom 0.305: ROT2.K10 ROT2.K12 | ROT2.K7 ROT2.K8 49.38,39.14 v49.38,59.44 | ROT2.K5 ROT2.K4 | ROT2.K2 ROT2.K1 | v128.02,59.44 128.02,50.09 131.37,46.73 DO_IC7B.12
MATRIXROT3  (via drill 0.33)
  Top 0.305: ROT3.K10 ROT3.K9 ROT3.K8 ROT3.K7 ROT3.K6 ROT3.K5 ROT3.K4 ROT3.K3 ROT3.K2 | v81.89,60.25 v128.83,60.25
  Bottom 0.305: ROT3.K1 ROT3.K2 | ROT3.K10 ROT3.K12 | 76.61,38.91 76.61,54.96 | v128.83,60.25 128.83,50.49 130.05,49.27 131.32,48.01 DO_IC7B.13
  Bottom 0.406: ROT3.K8 76.61,38.91 | 76.61,54.96 v81.89,60.25
MATRIXROT4  (via drill 0.33)
  Top 0.305: ROT4.K10 ROT4.K9 ROT4.K8 ROT4.K7 ROT4.K6 ROT4.K5 ROT4.K4 ROT4.K3 ROT4.K2 | v108.97,61.06 v129.64,61.06
  Bottom 0.305: ROT4.K1 ROT4.K2 | ROT4.K10 ROT4.K12 | ROT4.K8 104.44,39.21 104.44,47.25 108.99,51.79 v108.97,61.06 | v129.64,61.06 129.64,50.9 131.27,49.27 DO_IC7B.14
MATRIXROT5
  Top 0.305: ROT5.K9 ROT5.K8 ROT5.K7 ROT5.K6 ROT5.K5 ROT5.K4 ROT5.K3 ROT5.K2
  Bottom 0.305: ROT5.K1 ROT5.K2 | ROT5.K12 ROT5.K10 ROT5.K9 | 131.7,38.91 134.11,38.91 134.72,39.52 134.72,50.29 134.47,50.55 DO_IC7B.15
  Bottom 0.406: ROT5.K8 131.67,38.94 131.7,38.91
MATRIXROT6
  Top 0.305: ROT6.K10 ROT6.K9 ROT6.K8 ROT6.K7 ROT6.K6 ROT6.K5 ROT6.K4 ROT6.K3
  Bottom 0.305: ROT6.K1 ROT6.K2 ROT6.K3 | ROT6.K10 ROT6.K12 | 146.85,41.76 140.82,41.76 135.33,46.63 135.33,51.51 135.03,51.81 DO_IC7B.16
  Bottom 0.406: ROT6.K5 146.85,41.76
MATRIXROT7  (via drill 0.33)
  Top 0.305: ROT7.K10 ROT7.K9 ROT7.K8 ROT7.K7 ROT7.K6 ROT7.K5 ROT7.K4 ROT7.K3 ROT7.K2 | v131.67,59.44 v186.54,59.44
  Bottom 0.305: ROT7.K1 ROT7.K2 | ROT7.K10 ROT7.K12 | 131.93,53.09 131.27,53.74 131.27,59.03 v131.67,59.44 | v186.54,59.44 186.54,39.34 186.24,39.24 186.31,39.24 ROT7.K8
  Bottom 0.406: DO_IC7B.17 131.93,53.09
MATRIXROT8  (via drill 0.33)
  Top 0.305: ROT8.K10 ROT8.K9 ROT8.K8 ROT8.K7 ROT8.K6 ROT8.K5 ROT8.K4 ROT8.K3 ROT8.K2 | v190.6,58.62 v133.5,58.62
  Bottom 0.305: ROT8.K1 ROT8.K2 | ROT8.K4 198.25,39.02 | 198.12,39.15 198.12,51.1 v190.6,58.62 | v133.5,58.62 133.5,56.39 133.5,54.56
  Bottom 0.406: ROT8.K10 ROT8.K12 | 198.25,39.02 198.12,39.15 | 133.5,54.56 DO_IC7B.18
R1B  (via drill 0.33)
  Top 0.305: v9.96,13.51 30.91,13.51 35.38,9.05 v203.48,9.05
  Bottom 0.305: ROT1.LED_BLUE 15.75,33.43 9.96,27.63 v9.96,13.51 | v203.48,9.05 204.4,8.12 DO_R7.16
R1G  (via drill 0.33)
  Top 0.305: v9.14,12.7 30.2,12.7 34.75,8.21 34.88,8.08 v38.18,8.08
  Bottom 0.305: ROT1.LED_GREEN 12.19,39.3 12.19,30.99 9.14,27.94 v9.14,12.7 | v38.18,8.08 39.23,7.02 DO_R6.8
R1R  (via drill 0.33)
  Top 0.305: ROT1.LED_RED 11.18,41.17 11.18,41.57 11.18,54.56 v8.33,57.4
  Bottom 0.305: v8.33,57.4 8.33,58.4 8.56,58.63 13.92,58.63 14.32,58.22 DO_R5.8
R2B  (via drill 0.33)
  Top 0.305: v48.01,9.88 v205.61,9.88
  Bottom 0.305: ROT2.LED_BLUE 43.25,31.02 46.94,27.33 46.91,17.96 48.01,16.86 v48.01,9.88 | v205.61,9.88 206.1,9.39 DO_R7.15
R2G
  Bottom 0.305: ROT2.LED_GREEN 39.25,33.72 46.3,26.67 46.3,18.87 arc0 46.3,17.66 47.19,16.77 47.17,8.87 46.53,8.21 42.87,8.21 DO_R6.7
R2R  (via drill 0.33)
  Top 0.305: v38.81,49.68 v20.52,49.68
  Bottom 0.305: ROT2.LED_RED 38.81,41.3 v38.81,49.68 | v20.52,49.68 20.52,54.74 18.29,56.98 16.32,56.98 DO_R5.7
R3B  (via drill 0.33)
  Top 0.305: v63.8,10.87 202.59,10.87 v204.24,10.87 v204.24,10.88
  Bottom 0.305: ROT3.LED_BLUE 70.75,34.38 63.8,27.43 v63.8,10.87 | v204.24,10.88 206.12,10.88 206.38,10.62 207.19,10.62 DO_R7.14
R3G  (via drill 0.33)
  Top 0.305: v62.18,10.85 46.94,10.85 46.15,10.06 v46.13,10.06
  Bottom 0.305: ROT3.LED_GREEN 66.75,31.52 62.99,27.76 62.99,18.87 62.99,11.68 v62.18,10.85 | v46.13,10.06 45.63,9.56 DO_R6.6
R3R  (via drill 0.33)
  Top 0.305: v65.43,50.49 v19.71,50.49
  Bottom 0.305: ROT3.LED_RED 65.43,40.42 v65.43,50.49 | v19.71,50.49 19.71,54.13 18.09,55.76 16.37,55.76 DO_R5.6
R4B  (via drill 0.33)
  Top 0.305: v101.8,11.68 v202.39,11.68
  Bottom 0.305: ROT4.LED_BLUE 98.25,31.29 101.8,27.74 v101.8,11.68 | v202.39,11.68 206.22,11.68 206.48,11.94 207.22,11.94 DO_R7.13
R4G  (via drill 0.33)
  Top 0.305: v100.18,11.68 45.72,11.68 v44.91,10.87
  Bottom 0.305: ROT4.LED_GREEN 94.25,33.87 100.99,27.13 100.99,12.5 v100.18,11.68 | v44.91,10.87 44.87,10.83 DO_R6.5
R4R  (via drill 0.33)
  Top 0.305: v92.05,51.31 v18.9,51.31
  Bottom 0.305: ROT4.LED_RED 93.07,40.56 93.07,50.29 v92.05,51.31 | v18.9,51.31 18.9,53.32 17.88,54.33 16.38,54.33 DO_R5.5
R5B  (via drill 0.33)
  Top 0.305: v118.87,12.5 202.39,12.5 205.18,12.5 v205.44,12.76
  Bottom 0.305: 125.75,34.13 118.87,27.25 v118.87,12.5 | v205.44,12.76 205.88,13.2 DO_R7.12
  Bottom 0.406: ROT5.LED_BLUE 125.75,34.13
R5G  (via drill 0.33)
  Top 0.305: v117.45,12.5 v46.33,12.5
  Bottom 0.305: 121.75,31.43 118.06,27.74 118.06,13.11 v117.45,12.5 | v46.33,12.5 45.93,12.1 DO_R6.4
  Bottom 0.406: ROT5.LED_GREEN 121.75,31.43
R5R  (via drill 0.33)
  Top 0.305: v121.31,52.12 v18.09,52.12
  Bottom 0.305: ROT5.LED_RED 121.31,41.3 v121.31,52.12 | v18.09,52.12 17.06,53.14 DO_R5.4
R6B  (via drill 0.33)
  Top 0.305: v156.67,13.31 203.2,13.31 203.21,13.31 v203.94,13.31
  Bottom 0.305: ROT6.LED_BLUE 153.25,28.92 155.85,26.31 155.85,14.12 v156.67,13.31 | v203.94,13.31 205.1,14.47 DO_R7.11
R6G  (via drill 0.33)
  Top 0.305: v155.04,13.31 v44.5,13.31
  Bottom 0.305: ROT6.LED_GREEN 149.25,31.9 155.04,26.11 v155.04,13.31 | v44.5,13.31 44.44,13.37 DO_R6.3
R6R  (via drill 0.33)
  Top 0.305: v149.96,52.93 v14.83,52.93
  Bottom 0.305: ROT6.LED_RED 149.96,42.45 v149.96,52.93 | v14.83,52.93 14.83,52.1 15.04,51.9 16.27,51.9 DO_R5.3
R7B  (via drill 0.33)
  Top 0.305: v173.74,14.12 203.2,14.12 203.22,14.12 v204.62,15.52
  Bottom 0.305: 180.75,34.34 173.74,27.33 v173.74,14.12 | v173.74,14.12 173.74,14.1 v173.74,14.12 | v204.62,15.52 204.84,15.74 DO_R7.10
  Bottom 0.406: ROT7.LED_BLUE 180.75,34.34
R7G  (via drill 0.33)
  Top 0.305: v171.91,14.12 v45.72,14.12
  Bottom 0.305: ROT7.LED_GREEN 176.75,31.36 173.03,27.63 173.03,19.3 171.91,18.18 v171.91,14.12 | v45.72,14.12 45.2,14.64 DO_R6.2
R7R  (via drill 0.33)
  Top 0.305: v176.17,53.74 v14.02,53.74
  Bottom 0.305: ROT7.LED_RED 176.17,41.17 v176.17,53.74 | v14.02,53.74 14.02,51.29 14.63,50.68 16.22,50.68 DO_R5.2
R8B
  Bottom 0.305: 208.28,39.71 208.28,31.19 211.53,27.74 211.53,19.61 211.53,17.68 210.92,17.07 207.28,17.07 DO_R7.9
  Bottom 0.406: ROT8.LED_BLUE 208.28,39.71
R8G  (via drill 0.33)
  Top 0.305: v40.44,8.23 40.64,8.23 209.17,8.23 209.19,8.25 210.11,9.17 v210.11,18.77
  Bottom 0.305: ROT8.LED_GREEN 204.25,33.59 210.11,27.53 v210.11,18.77 | DO_R6.1 41.63,15.91 41.45,15.73 40.44,14.78 v40.44,8.23
R8R  (via drill 0.33)
  Top 0.305: v200.35,54.56 v13.21,54.56
  Bottom 0.305: ROT8.LED_RED 203.81,41.3 203.81,51.1 v200.35,54.56 | v13.21,54.56 13.21,50.47 14.35,49.33 DO_R5.1
RC-I  (via drill 0.33)
  Top 0.305: v184.91,52.32 187.76,49.48 215.59,49.48 216.91,49.48 218.44,51 218.44,61.37 217.22,62.59 214.58,62.59 213.97,61.98 J2.9 | v133.63,16.74 v86.26,16.74
  Bottom 0.305: v184.91,52.32 184.91,57.2 183.49,58.62 177.41,58.62 DI_IC3.1 177.1,57.31 175.16,55.37 175.16,44.4 173.13,42.37 173.13,35.66 174.96,33.83 174.96,30.78 172.31,28.14 172.31,25.53 169.9,23.11 169.87,23.06 168.1,21.29 166.57,21.29 DI_IC2.1 166.03,21.3 165.47,20.74 163.64,20.74 161.95,22.43 158.9,22.43 158.5,22.03 158.5,21.42 158.5,20.6 158.5,19.79 157.48,18.77 157.48,14.3 157.48,12.88 155.85,11.26 152.09,11.26 146.61,16.74 v133.63,16.74 | J1.9 3.2,61.22 4.67,62.69 7.11,62.69 9.55,60.25 20.93,60.25 22.96,62.28 36.98,62.28 38.2,61.06 56.29,61.06 56.69,60.65 56.69,45.62 65.84,36.47 65.84,31.8 62.18,28.14 62.18,16.11 59.4,13.32 DI_IC1.1 58.56,12.26 60.96,9.86 79.38,9.86 v86.26,16.74
RC-O  (via drill 0.33)  (1 unrouted)
  Top 0.305: v88.67,61.87 85.34,61.87 76.4,61.87 v75.59,61.06 46.53,61.06 45.72,60.25 39.83,60.25 v39.01,59.44 6.99,59.44 J1.10 4.5,59.44 2.64,59.44 2.44,59.23 2.03,58.83 2.03,49.68 2.64,49.07 v2.64,39.12 | v88.67,61.87 88.9,61.87 | 88.9,61.87 v88.67,61.87 | v88.67,61.87 102.62,61.87 103.43,62.69 v132.49,62.69 195.48,62.69 200.56,62.69 208.58,54.66 211.53,54.66 | v213.77,24.28 213.77,21.21 213.76,21.21 213.16,20.6 208.08,20.6 202.36,14.89 176.68,14.91 176.68,14.93 v176.66,14.96 | v11.99,20.62 4.88,20.62 v4.65,20.52 | v88.67,61.87 88.9,61.87 | 211.53,54.66 214.38,54.66 215.19,55.47 215.19,59.74 J2.10 | v211.53,51 211.53,54.66
  Bottom 0.305: DO_IC4_R.12 35.28,54.08 39.01,57.81 v39.01,59.44 | 69.49,56.39 70.92,56.39 v75.59,61.06 | DO_IC7.12 138.19,60.66 137.36,59.84 133.1,59.84 132.49,60.45 v132.49,62.69 | v213.77,24.28 214.78,25.3 217.22,27.74 217.22,29.97 217.22,30.38 217.22,37.69 213.56,41.35 213.56,48.97 v211.53,51 | DO_IC6_B.12 176.66,17.58 v176.66,14.96 | DO_IC5_G.12 12.13,20.48 v11.99,20.62 | v4.65,20.52 4.55,20.52 4.47,20.6 2.64,22.45 v2.64,39.12 | v88.67,61.88 88.67,62.09 89.23,62.67 93.78,67.24 96.65,67.24 98.25,68.84 98.25,71.26 DO_IC8.12
  Bottom 0.406: DO_IC9.12 69.48,56.38 69.49,56.39
ROT1A  (via drill 0.33)
  Top 0.305: DI_R2.4 29.77,15.78 v50.77,15.78
  Bottom 0.305: v50.77,15.78 53.48,18.35 DI_IC1.12
  Bottom 0.406: ROT1.A 12.71,26.7 17.07,26.7 21.13,22.64 22.96,22.64 26.15,19.44 DI_R2.4
ROT1B  (via drill 0.33)
  Top 0.305: DI_R2.5 28.07,14.94 v49.48,14.94
  Bottom 0.305: v49.48,14.94 49.58,14.94 49.58,15.73 52.23,18.38 DI_IC1.11
  Bottom 0.406: ROT1.B 19.87,21.62 21.54,21.62 23.61,19.55 DI_R2.5
ROT2A  (via drill 0.33)
  Top 0.305: v55.4,17.43 33.2,17.43 DI_R2.2
  Bottom 0.305: DI_IC1.14 56.02,18.05 v55.4,17.43
  Bottom 0.406: ROT2.A 35.13,21.62 33.53,21.62 31.3,19.39 DI_R2.2
ROT2B  (via drill 0.33)
  Top 0.305: v52.98,16.64 31.47,16.61 DI_R2.3
  Bottom 0.305: DI_IC1.13 54.75,18.02 54.25,17.55 53.7,17.55 v52.98,16.64
  Bottom 0.406: ROT2.B 42.29,26.7 37.8,26.7 33.73,22.64 31.9,22.64 28.69,19.43 DI_R2.3
ROT3A  (via drill 0.33)
  Top 0.305: v57.35,16.61 78.46,16.61 DI_R1.3
  Bottom 0.305: DI_IC1.4 54.76,13.34 54.76,13.82 v57.35,16.61
  Bottom 0.406: ROT3.A 67.71,26.7 72.14,26.7 73.97,26.7 81.23,19.43 DI_R1.3
ROT3B  (via drill 0.33)
  Top 0.305: v60.17,17.5 76.81,17.5 DI_R1.2
  Bottom 0.305: DI_IC1.3 56.02,13.94 56.01,13.95 59.56,17.5 v60.17,17.5
  Bottom 0.406: ROT3.B 71.9,25.25 73.03,25.25 76.61,21.62 78.69,19.54 DI_R1.2
ROT4A  (via drill 0.33)
  Top 0.305: DI_R1.5 81.92,14.96 v53.42,14.94
  Bottom 0.305: v53.42,14.94 52.21,13.71 DI_IC1.6
  Bottom 0.406: ROT4.A 90.13,21.62 88.59,21.62 86.36,19.38 DI_R1.5
ROT4B  (via drill 0.33)
  Top 0.305: DI_R1.4 80.21,15.78 v55.24,15.78
  Bottom 0.305: v55.24,15.78 53.48,13.71 DI_IC1.5
  Bottom 0.406: ROT4.B 97.29,26.7 92.86,26.7 88.8,22.64 86.97,22.64 83.77,19.43 DI_R1.4
ROT5A  (via drill 0.33)
  Top 0.305: DI_R4.4 139.45,16.23 v159.13,16.23
  Bottom 0.305: v159.13,16.23 159.6,16.22 DI_IC2.12
  Bottom 0.406: ROT5.A 122.71,26.7 127.2,26.7 131.27,22.64 133.1,22.64 136.3,19.43 DI_R4.4
ROT5B  (via drill 0.33)
  Top 0.305: DI_R4.5 138.18,14.96 v159.13,14.96
  Bottom 0.305: v159.13,14.96 159.19,14.95 DI_IC2.11
  Bottom 0.406: ROT5.B 129.87,21.62 131.47,21.62 133.71,19.38 DI_R4.5
ROT6A  (via drill 0.33)
  Top 0.305: v159.11,18.72 149.17,18.72 148.62,18.16 142.6,18.16 DI_R4.2
  Bottom 0.305: DI_IC2.14 158.99,18.76 v159.11,18.72
  Bottom 0.406: ROT6.A 145.13,21.62 143.66,21.62 141.43,19.38 DI_R4.2
ROT6B  (via drill 0.33)
  Top 0.305: v159.13,17.43 140.79,17.43 DI_R4.3
  Bottom 0.305: DI_IC2.13 161.07,17.43 v159.13,17.43
  Bottom 0.406: ROT6.B 152.29,26.7 147.93,26.7 144.07,22.84 142.44,22.84 138.99,19.38 DI_R4.3
ROT7A  (via drill 0.33)
  Top 0.305: v168.96,17.05 191.71,17.05 DI_R3.3
  Bottom 0.305: DI_IC2.4 168.52,17.49 v168.96,17.05
  Bottom 0.406: ROT7.A 177.71,26.7 182.47,26.7 186.54,22.64 192.02,22.64 194.57,20.09 DI_R3.3
ROT7B  (via drill 0.33)
  Top 0.305: v168.07,18.75 169.42,18.75 170.38,17.78 189.9,17.78 DI_R3.2
  Bottom 0.305: DI_IC2.3 v168.06,18.76 v168.07,18.75
  Bottom 0.406: ROT7.B 184.87,21.62 191.01,21.62 192.34,20.29 DI_R3.2
ROT8A  (via drill 0.33)
  Top 0.305: v169.04,14.94 175.41,14.94 176.2,15.73 176.25,15.78 195.51,15.78 DI_R3.5
  Bottom 0.305: DI_IC2.6 169.24,14.95 v169.04,14.94
  Bottom 0.406: ROT8.A 199.88,21.37 DI_R3.5
ROT8B  (via drill 0.33)
  Top 0.305: DI_R3.4 193.61,16.41 175.72,16.41 175.08,15.78 v168.15,15.78
  Bottom 0.305: v168.15,15.78 167.76,16.22 DI_IC2.5
  Bottom 0.406: ROT8.B 207.29,26.7 203,26.7 197.34,21.04 DI_R3.4
SC  (via drill 0.33)  (2 unrouted)
  Top 0.254: v176.48,60.35 176.48,61.87
  Top 0.305: J1.8 6.23,58.62 v37.59,58.62 39.62,58.62 40.44,59.44 46.13,59.44 46.94,60.25 v73.56,60.25 80.67,60.25 81.48,61.06 86.77,61.06 103.02,61.06 103.83,61.87 v133.3,61.87 176.48,61.87 200.15,61.87 v203.61,58.42 | v59.99,20.62 v45.31,20.62 16.15,20.62 13.61,20.62 v13.41,20.57 | v59.99,20.62 60.07,20.62 | 60.07,20.62 152.07,20.65 153.02,19.71 v177.39,19.68 arc90 v177.39,19.69 v169.14,19.69 | v59.99,20.62 60.07,20.62
  Top 0.406: J1.8 J1.7
  Bottom 0.254: DI_IC3.2 175.83,59.7 v176.48,60.35
  Bottom 0.305: DO_IC4_R.13 34.01,54.64 36.37,57 37.19,57 37.59,57.4 v37.59,58.62 | DO_IC9.11 70.96,57.65 v73.56,60.25 | DO_IC7.11 136.92,61.02 136.55,60.65 133.5,60.65 133.3,60.86 v133.3,61.87 | v203.61,58.42 213.47,58.31 213.76,58.31 J2.7 J2.8 | DO_IC6_B.13 177.93,19.15 v177.39,19.68 | v13.41,20.57 DO_IC5_G.13 | 33.93,48.84 33.93,47.45 33.73,47.24 32.92,47.24 30.28,44.8 30.28,33.42 33.73,29.97 41.45,29.97 45.31,26.11 v45.31,20.62 | 86.78,61.06 v86.77,61.04 86.77,61.14 93.47,67.85 95.99,67.85 96.98,68.84 96.98,71.26 DO_IC8.11 | DI_IC1.2 57.29,14.01 57.3,14.03 59.33,16.06 60.48,16.06 61.32,16.89 61.32,18.42 59.99,19.74 v59.99,20.62 | DI_IC2.2 168.8,20.03 v169.14,19.7
  Bottom 0.406: DO_IC5_G.13 | DO_IC4_R.13 33.93,48.84
SI-INPUT  (via drill 0.33)
  Top 0.305: v163.37,63.5 200.76,63.5 207.26,57 208.28,55.98 213.58,55.98 J2.5
  Bottom 0.254: DI_R6.6 165.05,44.96 164.79,45.21 164.79,62.28 165.71,63.19 169.16,63.19 169.47,63.5 169.47,64.35 DI_IC3.10
  Bottom 0.406: v163.37,63.5 165.41,65.53 169.06,65.53 169.48,65.11 DI_IC3.10 169.47,64.35
SI-OUTPUT  (via drill 0.33)
  Top 0.305: v7.32,41.35 7.11,41.55 7.11,46.63 8.74,48.26 8.74,52.12 6.5,54.35 4.45,54.35 J1.5 | v8.33,15.75 9.72,14.36 22.43,14.36 v23.85,15.78 | v44.65,18.27 45.29,18.9 v48.06,18.9
  Bottom 0.305: 8.33,15.95 8.33,16.36 8.33,28.14 11.18,30.99 11.18,35.46 8.53,38.1 8.53,40.13 v7.32,41.35 | v23.85,15.78 25.43,17.38 25.45,17.4 26.19,18.14 44.55,18.14 44.65,18.24 v44.65,18.27 | v48.06,18.9 49.58,18.91 DI_IC1.9 49.61,18.81 49.61,18.9 49.63,18.88 49.63,18.8
  Bottom 0.406: v8.33,15.75 8.33,15.95
SO-INPUT
  Bottom 0.305: J1.6 4.47,56.87 4.47,61.26 5.08,61.87 6.71,61.87 9.14,59.44 21.13,59.44 23.16,61.47 27.03,61.47 27.66,60.83 DO_IC4_R.3
SO-OUTPUT  (via drill 0.33)
  Top 0.305: v89.41,65.87 128.02,65.87 129.54,65.87 131.09,64.32 137.69,64.32 137.69,64.31 v179.02,64.31
  Bottom 0.305: v179.02,64.31 185.93,64.29 187.96,62.26 197.71,62.26 204.22,55.77 205.33,54.66 215.19,54.66 J2.6 | v89.41,65.87 87.14,63.6 74.07,63.6 70.71,60.25 70.65,60.19 DO_IC9.9
SW1  (via drill 0.33)
  Top 0.305: ROT1.SWITCH 13.82,39.81 13.82,40.74 21.95,48.87 v181.46,48.87
  Bottom 0.305: v181.46,48.87 180.7,48.11 DI_IC3B.8
SW2  (via drill 0.33)
  Top 0.305: v43.69,49.68 43.89,49.68 v180.65,49.68
  Bottom 0.305: ROT2.SWITCH 43.69,42.18 v43.69,49.68 | v180.65,49.68 180.34,49.38 DI_IC3B.7
SW3  (via drill 0.33)
  Top 0.305: v71.12,50.49 v181.46,50.49
  Bottom 0.305: ROT3.SWITCH 71.12,42.11 v71.12,50.49 | v181.46,50.49 181.31,50.65 DI_IC3B.6
SW4  (via drill 0.33)
  Top 0.305: v100.58,51.31 v182.27,51.31
  Bottom 0.305: ROT4.SWITCH 100.58,44.08 v100.58,51.31 | v182.27,51.31 181.66,51.92 DI_IC3B.5
SW5  (via drill 0.33)
  Top 0.305: v126.19,52.12 178.21,52.12 179.02,52.93 v181.05,52.93
  Bottom 0.305: ROT5.SWITCH 126.19,42.18 v126.19,52.12 | v181.05,52.93 180.8,53.19 DI_IC3B.4
SW6  (via drill 0.33)
  Top 0.305: v153.62,52.93 177.8,52.93 178.61,53.74 v181.86,53.74
  Bottom 0.305: ROT6.SWITCH 153.62,42.11 v153.62,52.93 | v181.86,53.74 181.15,54.46 DI_IC3B.3
SW7
  Bottom 0.305: ROT7.SWITCH 181.25,42.25 181.98,42.98 182.07,43.06 182.07,44.2 183.19,45.31 183.19,54.66 182.12,55.73 DI_IC3B.2
SW8  (via drill 0.33)
  Top 0.305: v205.84,53.74 v184.1,53.74
  Bottom 0.305: ROT8.SWITCH 207.67,41.16 207.67,51.92 v205.84,53.74 | v184.1,53.74 184.1,56.39 183.49,57 DI_IC3B.1

## Text on the board
tNames: RC2 | RC1 | RC2 | RC1 | SC | SC | SI | SO | SI | SO | 5V | 5V | GND | GND
tValues: R13 | R12 | R11
bValues: row 9-11 | red | sel | switch | row 1-8 | 1 | 2 | 3 | 4 | 5 | 6 | 7 | 8 | green | blue